# Altium schematic sheet Display7SegULN2003.SCHDOC
size B
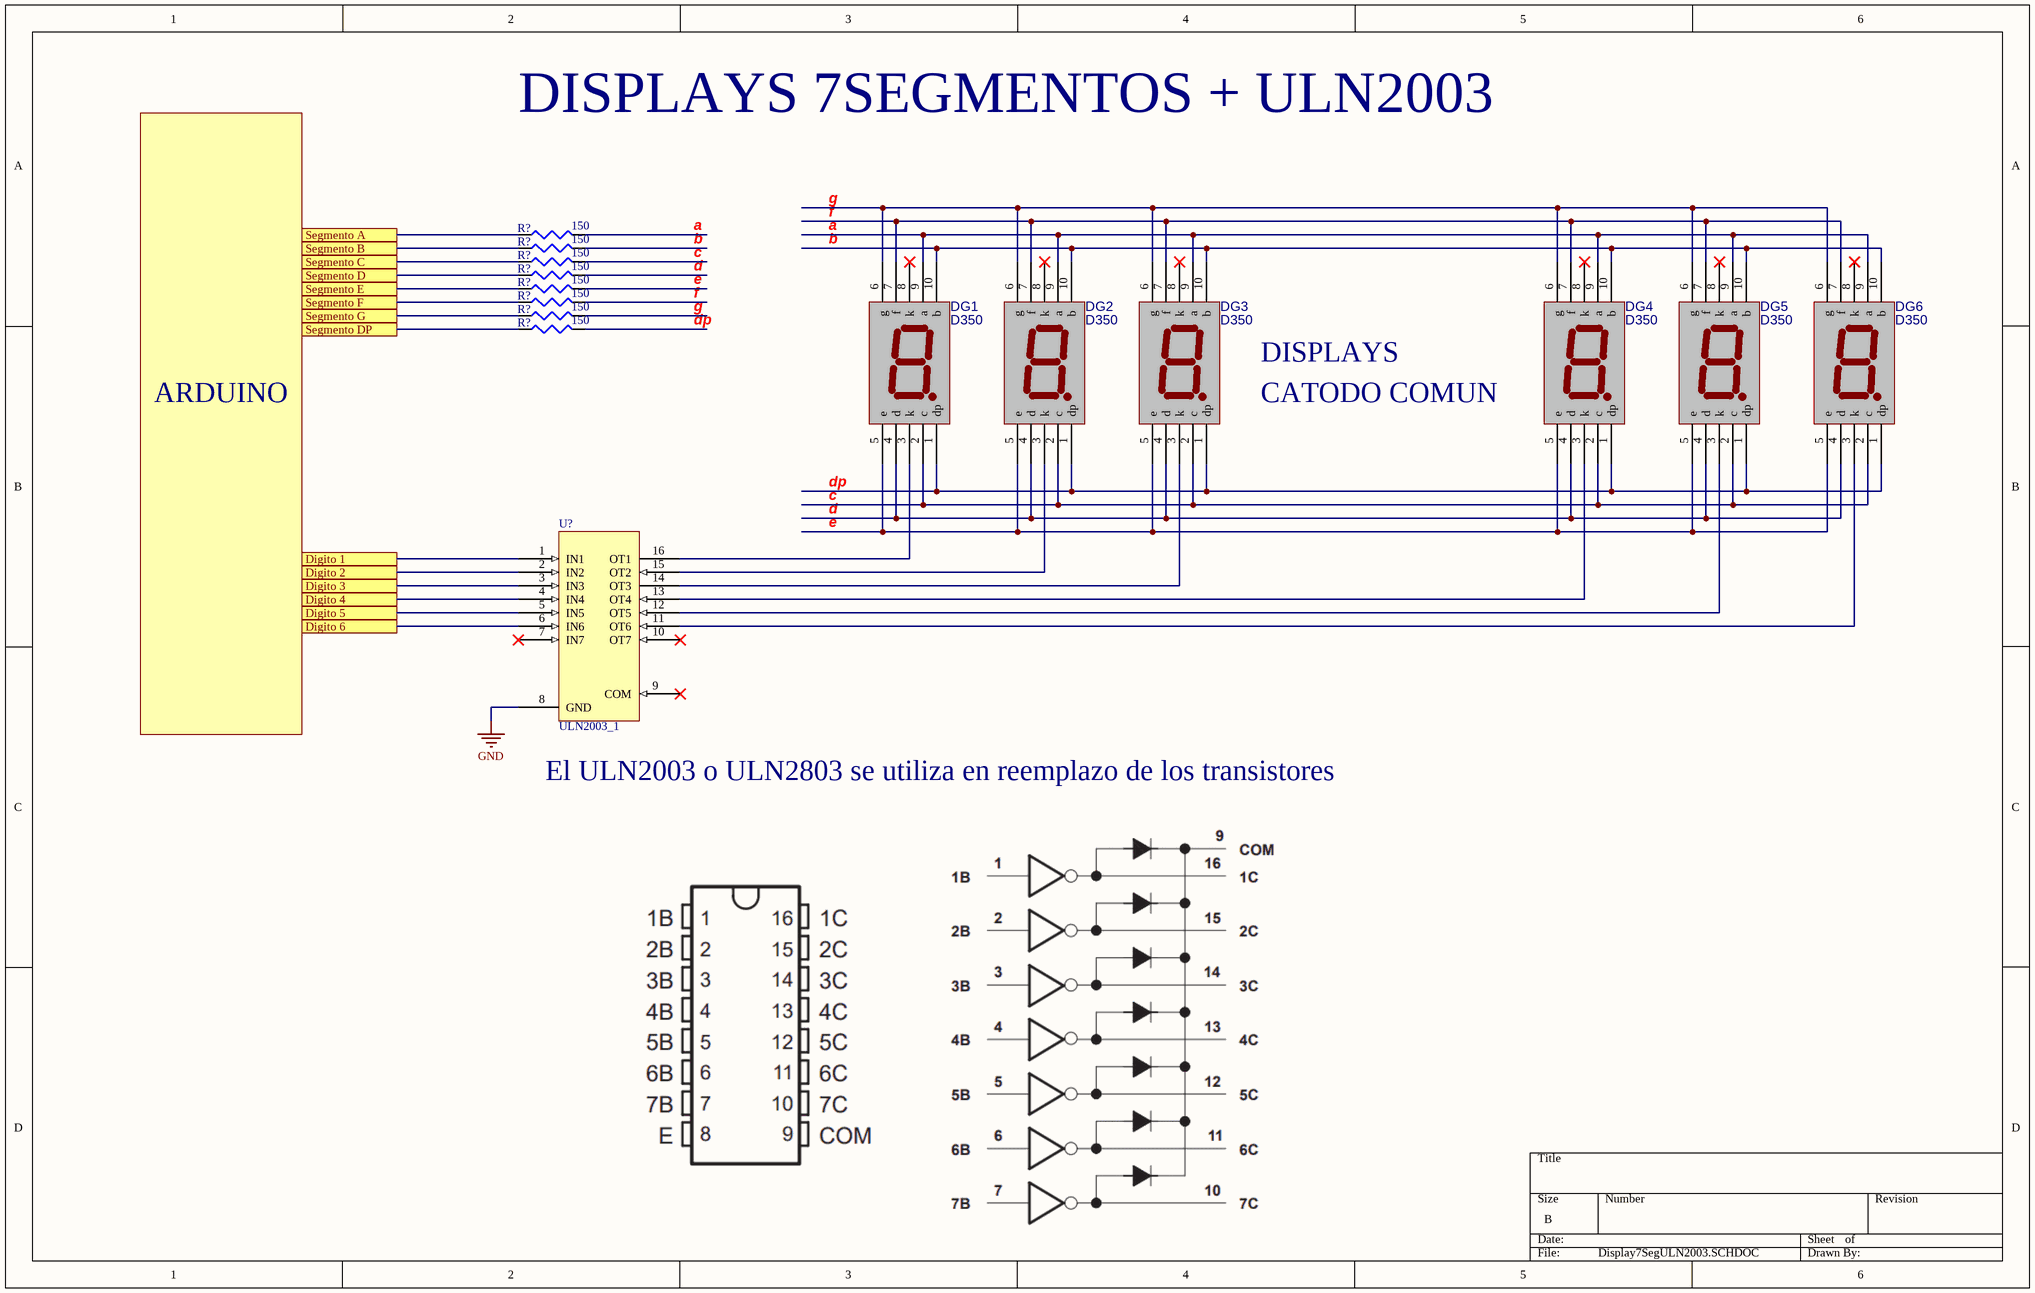
[diagram p0: Display7SegULN2003.SCHDOC]

## Parts
(Parts that share a designator on the sheet are numbered #1, #2 ... from top to bottom, then left to right.)
DG1  D350  [DIGIT0.7]
DG2  D350  [DIGIT0.7]
DG3  D350  [DIGIT0.7]
DG4  D350  [DIGIT0.7]
DG5  D350  [DIGIT0.7]
DG6  D350  [DIGIT0.7]
R?#1  150  [AXIAL0.3]
R?#2  150  [AXIAL0.3]
R?#3  150  [AXIAL0.3]
R?#4  150  [AXIAL0.3]
R?#5  150  [AXIAL0.3]
R?#6  150  [AXIAL0.3]
R?#7  150  [AXIAL0.3]
R?#8  150  [AXIAL0.3]
U?  ULN2003_1  [DIP16]

## Ports
Digito 1, Digito 2, Digito 3, Digito 4, Digito 5, Digito 6, Segmento A, Segmento B, Segmento C, Segmento D, Segmento DP, Segmento E, Segmento F, Segmento G

## Nets
GND: U?.8(GND)
a: DG1.9(a) DG2.9(a) DG3.9(a) DG4.9(a) DG5.9(a) DG6.9(a) R?#1.2
b: DG1.10(b) DG2.10(b) DG3.10(b) DG4.10(b) DG5.10(b) DG6.10(b) R?#2.2
c: DG1.2(c) DG2.2(c) DG3.2(c) DG4.2(c) DG5.2(c) DG6.2(c) R?#3.2
d: DG1.4(d) DG2.4(d) DG3.4(d) DG4.4(d) DG5.4(d) DG6.4(d) R?#4.2
Digito 1: U?.1(IN1) ; port Digito 1
Digito 2: U?.2(IN2) ; port Digito 2
Digito 3: U?.3(IN3) ; port Digito 3
Digito 4: U?.4(IN4) ; port Digito 4
Digito 5: U?.5(IN5) ; port Digito 5
Digito 6: U?.6(IN6) ; port Digito 6
dp: DG1.1(dp) DG2.1(dp) DG3.1(dp) DG4.1(dp) DG5.1(dp) DG6.1(dp) R?#8.2
e: DG1.5(e) DG2.5(e) DG3.5(e) DG4.5(e) DG5.5(e) DG6.5(e) R?#5.2
f: DG1.7(f) DG2.7(f) DG3.7(f) DG4.7(f) DG5.7(f) DG6.7(f) R?#6.2
g: DG1.6(g) DG2.6(g) DG3.6(g) DG4.6(g) DG5.6(g) DG6.6(g) R?#7.2
Segmento A: R?#1.1 ; port Segmento A
Segmento B: R?#2.1 ; port Segmento B
Segmento C: R?#3.1 ; port Segmento C
Segmento D: R?#4.1 ; port Segmento D
Segmento DP: R?#8.1 ; port Segmento DP
Segmento E: R?#5.1 ; port Segmento E
Segmento F: R?#6.1 ; port Segmento F
Segmento G: R?#7.1 ; port Segmento G
NetDG1_3: DG1.3(k) U?.16(OT1)
NetDG2_3: DG2.3(k) U?.15(OT2)
NetDG3_3: DG3.3(k) U?.14(OT3)
NetDG4_3: DG4.3(k) U?.13(OT4)
NetDG5_3: DG5.3(k) U?.12(OT5)
NetDG6_3: DG6.3(k) U?.11(OT6)

Not connected (* = marked no-connect by the designer): DG1 8(k)*; DG2 8(k)*; DG3 8(k)*; DG4 8(k)*; DG5 8(k)*; DG6 8(k)*; U? 7(IN7)* 9(COM)* 10(OT7)*

## Notes on the sheet
- DISPLAYS 7SEGMENTOS + ULN2003
- DISPLAYS
- ARDUINO
- CATODO COMUN
- (near U?) El ULN2003 o ULN2803 se utiliza en reemplazo de los transistores

## Library data of the parts
DG1-DG3 = DGT350: DIGITO DE 1/2 PULGADA; Text Field1: 0,4; 0.54: .54
DG4-DG6 = DGT350: DIGITO DE 1/2 PULGADA; Text Field1: 0,4; 0.54: *
R?#1-R?#8 = RES: Resistor; Text Field1: 0,012